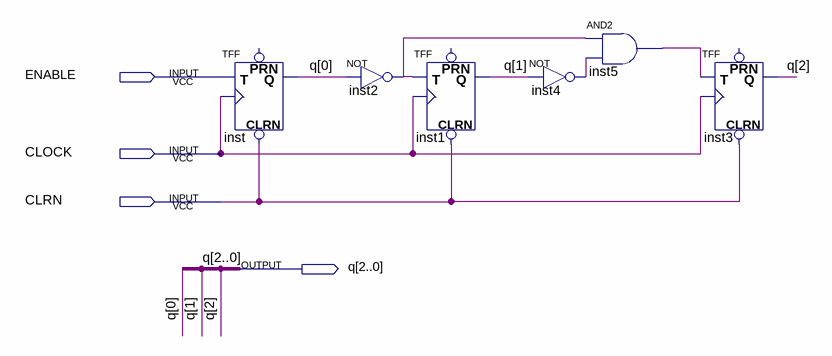
[diagram p0: schematic sheet]
// Quartus schematic mod_8_dcounter.bdf as structural Verilog: 6 symbols, 4 pins
module mod_8_dcounter (
  input  ENABLE,
  input  CLOCK,
  input  CLRN,
  output [2:0] q
);

  wire inst2_out, inst4_out, inst5_out;

  TFF inst (.CLRN(CLRN), .T(ENABLE), .CLK(CLOCK), .Q(q[0]));  // open: PRN
  not inst2 (inst2_out, q[0]);
  TFF inst1 (.CLRN(CLRN), .T(inst2_out), .CLK(CLOCK), .Q(q[1]));  // open: PRN
  not inst4 (inst4_out, q[1]);
  and inst5 (inst5_out, inst2_out, inst4_out);
  TFF inst3 (.CLRN(CLRN), .T(inst5_out), .CLK(CLOCK), .Q(q[2]));  // open: PRN
endmodule
